# Altium schematic sheet GOST_A3_2.SchDoc: Название
size 420 x 297 mm; DocumentNumber: АБВГ.ХХХХХХ.001 Э3; SheetNumber: 1; SheetTotal: 1; type: Схема электрическая принципиальная
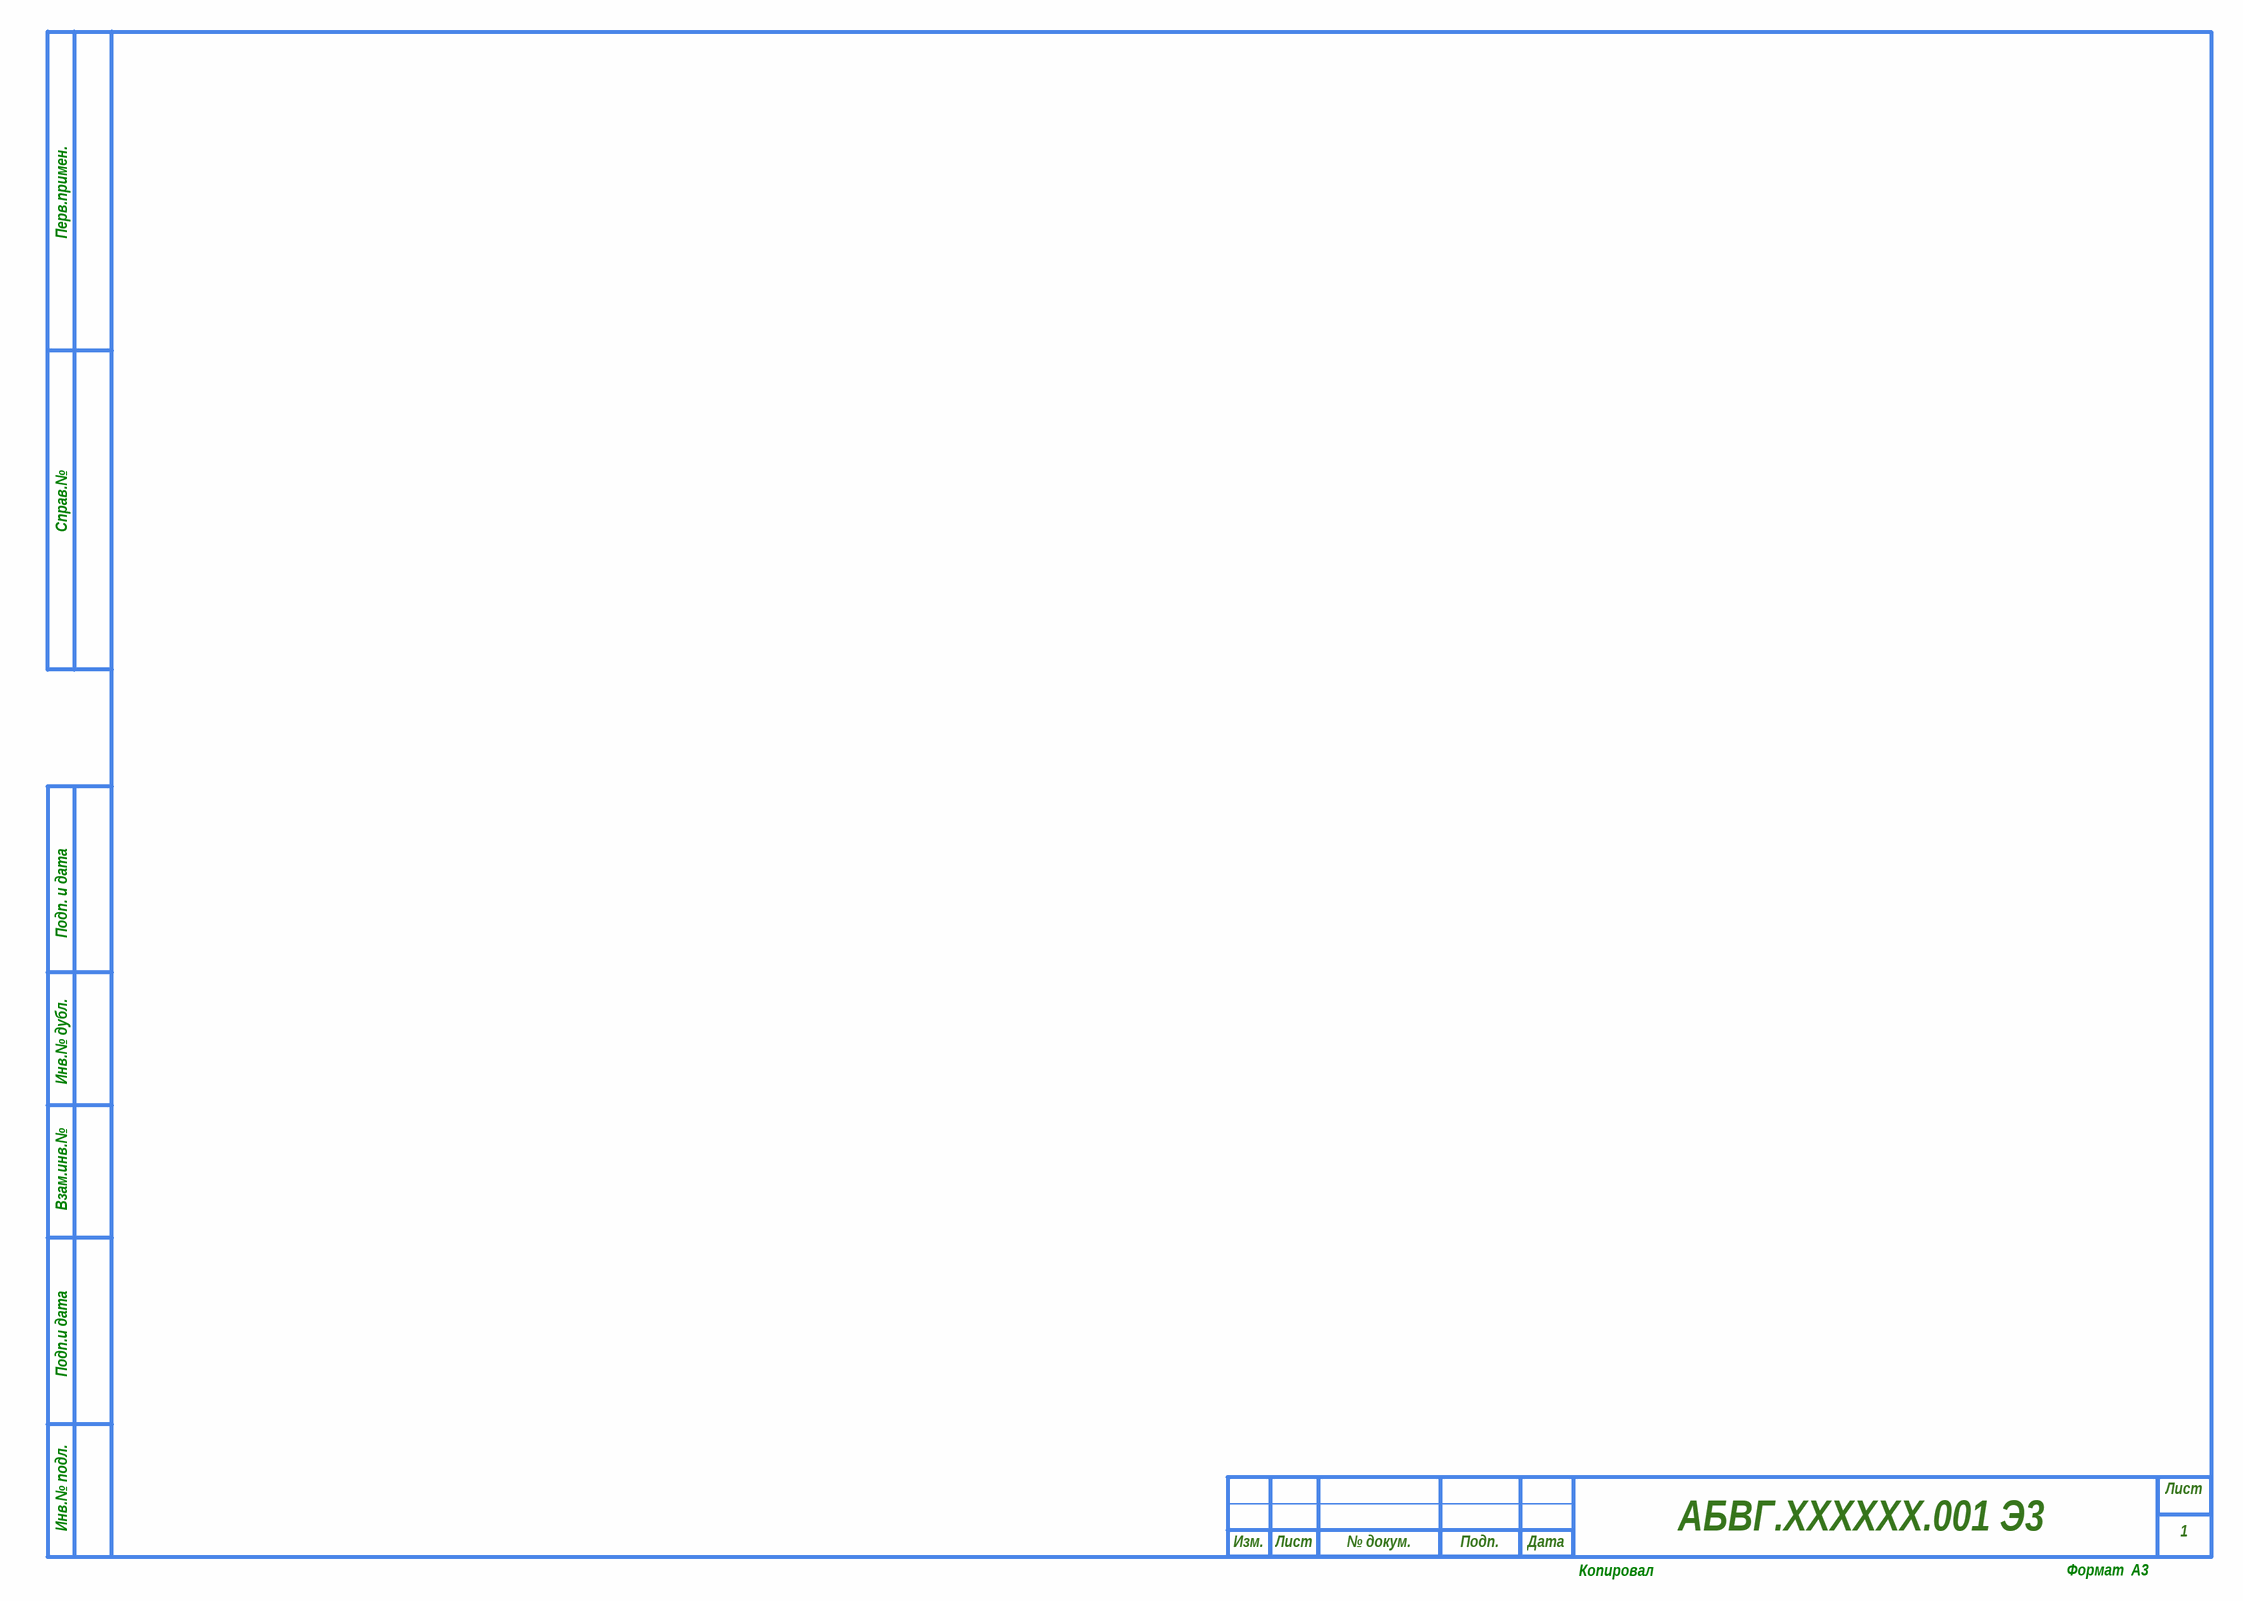
[diagram p0: GOST_A3_2.SchDoc]

## Notes on the sheet
- Перв.примен.
- Справ.№
- Подп. и дата
- Инв.№ дубл.
- Взам.инв.№
- Подп.и дата
- Инв.№ подл.
- Лист
- Изм.
- № докум.
- Подп.
- Дата
- Копировал
- Формат  A3
- Перв. примен.
- Справ. №
- Инв. № дубл.
- Взам. инв. №
- Разраб.
- Лит.
- Масса
- Масштаб
- Пров.
- Т. контр.
- Листов
- Инв. № подл.
- Н. контр.
- Утв.
- Формат А3